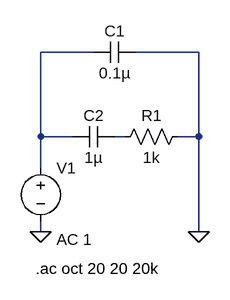
[diagram p0: schematic Filter Zero.asc]
Filter Zero.asc, the LTspice schematic file:
Version 4
SHEET 1 880 876
WIRE 144 144 64 144
WIRE 304 144 208 144
WIRE 64 272 64 144
WIRE 112 272 64 272
WIRE 192 272 176 272
WIRE 304 272 304 144
WIRE 304 272 272 272
WIRE 64 320 64 272
WIRE 64 416 64 400
WIRE 304 416 304 272
FLAG 304 416 0
FLAG 64 416 0
SYMBOL cap 208 128 R90
WINDOW 0 0 32 VBottom 2
WINDOW 3 32 32 VTop 2
SYMATTR InstName C1
SYMATTR Value 0.1µ
SYMBOL cap 176 256 R90
WINDOW 0 0 32 VBottom 2
WINDOW 3 32 32 VTop 2
SYMATTR InstName C2
SYMATTR Value 1µ
SYMBOL voltage 64 304 R0
WINDOW 3 24 152 Left 2
WINDOW 123 24 124 Left 2
WINDOW 39 0 0 Left 0
SYMATTR Value ""
SYMATTR Value2 AC 1
SYMATTR InstName V1
SYMBOL res 288 256 R90
WINDOW 0 0 56 VBottom 2
WINDOW 3 32 56 VTop 2
SYMATTR InstName R1
SYMATTR Value 1k
TEXT 56 472 Left 2 !.ac oct 20 20 20k

The netlist it stands for:
* Filter Zero.asc
C1 0 N001 0.1µ
C2 N002 N001 1µ
V1 N001 0 AC 1
R1 0 N002 1k
.ac oct 20 20 20k
.backanno
.end